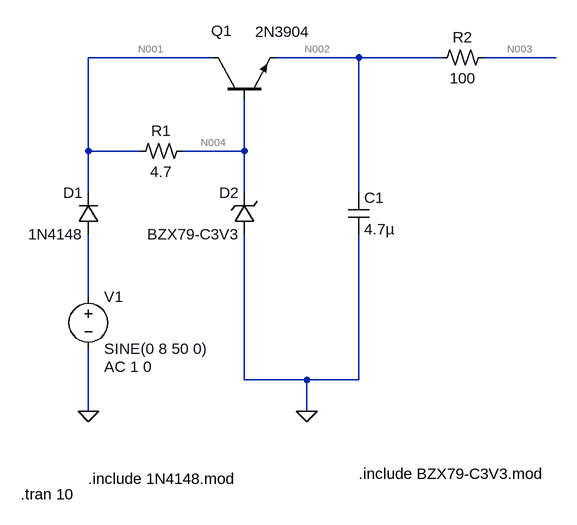
[diagram p0: schematic 10AC to 3.3DC Version 1(busbar voltage).asc]
10AC to 3.3DC Version 1(busbar voltage).asc, the LTspice schematic file:
Version 4
SHEET 1 880 680
WIRE 112 -128 -80 -128
WIRE 336 -128 208 -128
WIRE 464 -128 336 -128
WIRE 640 -128 528 -128
WIRE -80 16 -80 -128
WIRE 0 16 -80 16
WIRE 160 16 160 -64
WIRE 160 16 64 16
WIRE -80 80 -80 16
WIRE 160 80 160 16
WIRE 336 80 336 -128
WIRE -80 240 -80 144
WIRE 160 368 160 144
WIRE 256 368 160 368
WIRE 336 368 336 144
WIRE 336 368 256 368
WIRE -80 416 -80 320
WIRE 256 416 256 368
FLAG -80 416 0
FLAG 256 416 0
SYMBOL diode -64 144 R180
WINDOW 0 24 64 Left 2
WINDOW 3 24 0 Left 2
SYMATTR InstName D1
SYMATTR Value 1N4148
SYMBOL npn 112 -64 R270
WINDOW 0 105 -3 VRight 2
WINDOW 3 104 65 VRight 2
SYMATTR InstName Q1
SYMATTR Value 2N3904
SYMBOL res2 64 0 R90
WINDOW 0 0 32 VBottom 2
WINDOW 3 32 32 VTop 2
SYMATTR InstName R1
SYMATTR Value 4.7
SYMBOL res2 528 -144 R90
WINDOW 0 0 32 VBottom 2
WINDOW 3 32 32 VTop 2
SYMATTR InstName R2
SYMATTR Value 100
SYMBOL cap 320 80 R0
SYMATTR InstName C1
SYMATTR Value 4.7µ
SYMBOL voltage -80 224 R0
WINDOW 123 24 124 Left 2
WINDOW 39 0 0 Left 0
SYMATTR Value2 AC 1 0
SYMATTR InstName V1
SYMATTR Value SINE(0 8 50 0)
SYMBOL zener 176 144 R180
WINDOW 0 24 64 Left 2
WINDOW 3 24 0 Left 2
SYMATTR InstName D2
SYMATTR Value BZX79-C3V3
TEXT -80 520 Left 2 !.include 1N4148.mod
TEXT -184 544 Left 2 !.tran 10
TEXT 336 512 Left 2 !.include BZX79-C3V3.mod

The netlist it stands for:
* 10AC to 3.3DC Version 1(busbar voltage).asc
D1 N005 N001 1N4148
Q1 N001 N004 N002 0 2N3904
R1 N004 N001 4.7
R2 N003 N002 100
C1 N002 0 4.7µ
V1 N005 0 SINE(0 8 50 0) AC 1 0
D2 0 N004 BZX79-C3V3
.model D D
.lib standard.dio
.model NPN NPN
.model PNP PNP
.lib standard.bjt
.include 1N4148.mod
.tran 10
.include BZX79-C3V3.mod
.backanno
.end

* Results of the author's LTspice run, read from the files saved beside the schematic
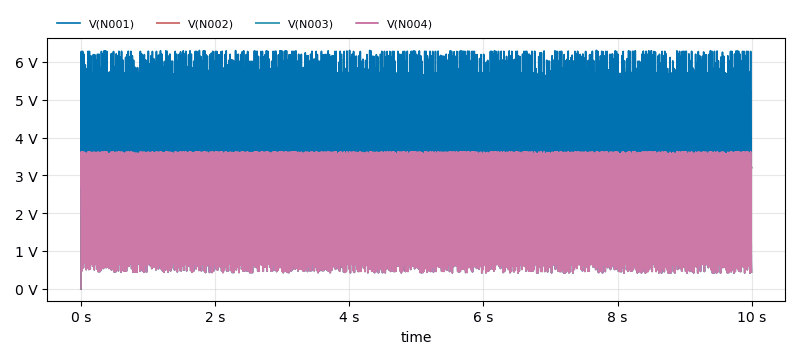
[diagram p1: Transient Analysis of 10AC to 3.3DC Version 1(busbar voltage).asc, plotted from the saved traces]
* Transient Analysis, 1 run:
*   V(N001): min 0 V, max 6.308 V, average 2.587 V, rms 3.31 V, last 864.6 mV
*   V(N002): min 0 V, max 3.204 V, average 3.178 V, rms 3.178 V, last 3.204 V
*   V(N003): min 0 V, max 3.204 V, average 3.178 V, rms 3.178 V, last 3.204 V
*   V(N004): min 0 V, max 3.625 V, average 2.02 V, rms 2.389 V, last 864.6 mV